# Altium project VCB20.PrjPCB (part 2 of 2)

## Sheet 9-Other_Inputs.SchDoc
size A4
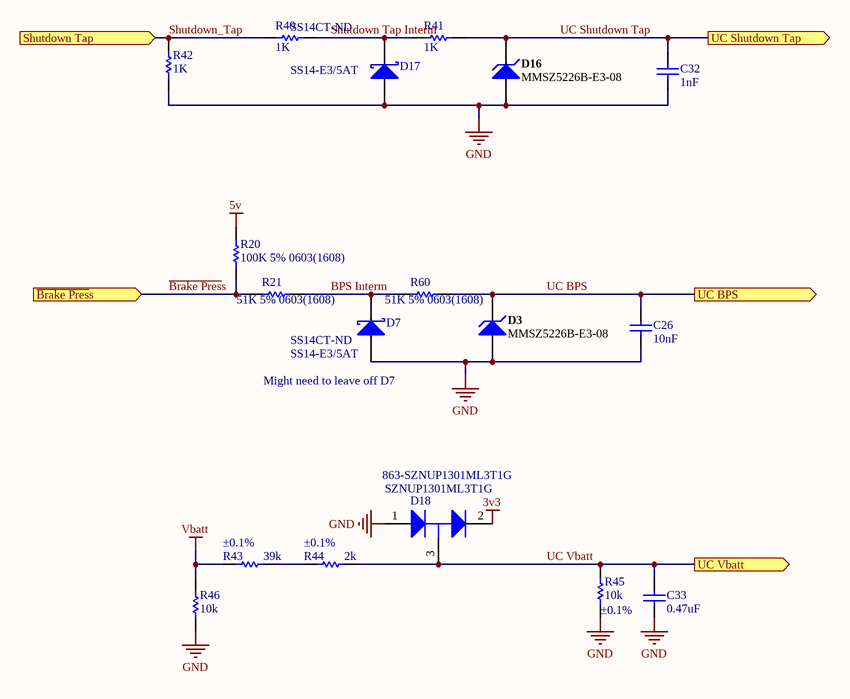
[diagram p6: 9-Other_Inputs.SchDoc]

### Parts
C26  value 10nF  [1608[0603]]  (hidden comment: Cap)
C32  value 1nF  [1608[0603]]  (hidden comment: Cap)
C33  value 0.47uF  [1608[0603]]  (hidden comment: Cap)
D3  MMSZ5226B-E3-08  [VISH-SOD-123-2_V]
D7  SS14-E3/5AT  Supplier Part Number 1: SS14CT-ND  [VISH-DO-214AC-2_V]
D16  MMSZ5226B-E3-08  [VISH-SOD-123-2_V]
D17  SS14-E3/5AT  Supplier Part Number 1: SS14CT-ND  [VISH-DO-214AC-2_V]
D18  SZNUP1301ML3T1G  Supplier Part Number 1: 863-SZNUP1301ML3T1G  [ONSC-SOT-23-3-318-08_V]
R20  100K 5% 0603(1608)  [RESC0603(1608)_N]
R21  51K 5% 0603(1608)  [RESC0603(1608)_N]
R40  value 1K  [1608[0603]]  (hidden comment: Res1)
R41  value 1K  [1608[0603]]  (hidden comment: Res1)
R42  value 1K  [1608[0603]]  (hidden comment: Res1)
R43  value 39k  Tolerance: ±0.1%  [1608[0603]]  (hidden comment: Res1)
R44  value 2k  Tolerance: ±0.1%  [1608[0603]]  (hidden comment: Res1)
R45  value 10k  Tolerance: ±0.1%  [1608[0603]]  (hidden comment: Res1)
R46  value 10k  [1608[0603]]  (hidden comment: Res1)
R60  51K 5% 0603(1608)  [RESC0603(1608)_N]

### Ports
Shutdown Tap (in), UC BPS (out), UC Shutdown Tap (out), UC Vbatt (out), ~{Brake Pres}s (in)

### Nets
3v3: D18.2(K)
5v: R20.2
GND: C26.1 C32.1 C33.1 D3.1(A) D7.1(A) D16.1(A) D17.1(A) D18.1(A) R42.1 R45.1 R46.1
Vbatt: R43.1 R46.2
~{Brake Pres}s: R20.1 R21.1 ; port ~{Brake Pres}s
BPS Interm: D7.2(K) R21.2 R60.1
Shutdown Tap Interm: D17.2(K) R40.1 R41.2
Shutdown_Tap: R40.2 R42.2 ; port Shutdown Tap  [project net Shutdown Tap]
UC BPS: C26.2 D3.2(K) R60.2 ; port UC BPS
UC Shutdown Tap: C32.2 D16.2(K) R41.1 ; port UC Shutdown Tap
UC Vbatt: C33.2 D18.3(K/A) R44.2 R45.2 ; port UC Vbatt
NetR43_2: R43.2 R44.1

### Notes on the sheet
- (near D7) Might need to leave off D7

### Library data of the parts
C26 = Cap: Capacitor; Manufacturer: Yageo; Manufacturer Part Number: CC0603KRX7R9BB104; Capacitance: 0.10µF; Tolerance: ±10%; Voltage - Rated: 50V; Temperature Coefficient: X7R; Supplier 1: Digi-Key; Supplier Part Number 1: 311-1344-1-ND; RoHS: RoHS Compliant; Category: Capacitors; Stock 1: 4016262; Pricing 1: 1=0.15, 10=0.043, 25=0.0312, 50=0.0232, 100=0.0189, 250=0.0158, 500=0.01346, 1000=0.01059 (CAD); Packaging: Cut Tape (CT); Part Status: Active; Operating Temperature: -55°C ~ 125°C; Features: -; Ratings: -; Applications: General Purpose; Failure Rate: -; Mounting Type: Surface Mount, MLCC; Package / Case: 0603 (1608 Metric); Size / Dimension: 0.063" L x 0.031" W (1.60mm x 0.80mm); Height - Seated (Max): -; Thickness (Max): 0.035" (0.90mm); Lead Spacing: -; Lead Style: -; ComponentLink1URL: http://www.yageo.com/documents/recent/UPY-GPHC_X7R_6.3V-to-50V_16.pdf; ComponentLink1Description: http://www.yageo.com/documents/recent/UPY-GPHC_X7R_6.3V-to-50V_16.pdf
C32 = Cap: Capacitor; Manufacturer: Yageo; Manufacturer Part Number: CC0603KRX7R9BB102; Capacitance: 1000pF; Tolerance: ±10%; Voltage - Rated: 50V; Temperature Coefficient: X7R; Supplier 1: Digi-Key; Supplier Part Number 1: 311-1080-1-ND; RoHS: RoHS Compliant; Category: Capacitors; Stock 1: 783486; Pricing 1: 1=0.15, 10=0.029, 25=0.0212, 50=0.0158, 100=0.0129, 250=0.01084, 500=0.00928, 1000=0.00729 (CAD); Packaging: Cut Tape (CT); Part Status: Active; Operating Temperature: -55°C ~ 125°C; Features: -; Ratings: -; Applications: General Purpose; Failure Rate: -; Mounting Type: Surface Mount, MLCC; Package / Case: 0603 (1608 Metric); Size / Dimension: 0.063" L x 0.031" W (1.60mm x 0.80mm); Height - Seated (Max): -; Thickness (Max): 0.035" (0.90mm); Lead Spacing: -; Lead Style: -; ComponentLink1URL: http://www.yageo.com/documents/recent/UPY-GPHC_X7R_6.3V-to-50V_16.pdf; ComponentLink1Description: http://www.yageo.com/documents/recent/UPY-GPHC_X7R_6.3V-to-50V_16.pdf
C33 = Cap: Capacitor; Manufacturer: Yageo; Manufacturer Part Number: CC0603KRX7R8BB474; Capacitance: 0.47µF; Tolerance: ±10%; Voltage - Rated: 25V; Temperature Coefficient: X7R; Supplier 1: Digi-Key; Supplier Part Number 1: 311-1805-1-ND; RoHS: RoHS Compliant; Category: Capacitors; Stock 1: 11076; Pricing 1: 1=0.22, 10=0.158, 25=0.1156, 50=0.0898, 100=0.0745, 250=0.06168, 500=0.05226, 1000=0.04324 (CAD); Packaging: Cut Tape (CT); Part Status: Active; Operating Temperature: -55°C ~ 125°C; Features: -; Ratings: -; Applications: General Purpose; Failure Rate: -; Mounting Type: Surface Mount, MLCC; Package / Case: 0603 (1608 Metric); Size / Dimension: 0.063" L x 0.031" W (1.60mm x 0.80mm); Height - Seated (Max): -; Thickness (Max): 0.035" (0.90mm); Lead Spacing: -; Lead Style: -; ComponentLink1URL: http://www.yageo.com/documents/recent/UPY-GPHC_X7R_6.3V-to-50V_16.pdf; ComponentLink1Description: http://www.yageo.com/documents/recent/UPY-GPHC_X7R_6.3V-to-50V_16.pdf
D3 D16 = CMP-0931-00026-1: Small Signal Zener Diode, 3.3 V +/- 5%, -55 to 155 degC, 2-Pin SOD-123, RoHS, Tape and Reel; Manufacturer: Vishay Semiconductor; Manufacturer Part Number: MMSZ5226B-7-F; Tolerance: +/- 5%; Test Current (IZT1) (mA): 20; Power Dissipation (mW): 500; Int. Construction: Single; Zener Impedance (IZT1) (Max.) (Ohm): 28; Zener Voltage (NOM.) (V): 3.3; Voltage - Zener (Nom) (Vz): 3.3V; Power - Max: 500mW; Impedance (Max) (Zzt): 28 Ohm; Current - Reverse Leakage @ Vr: 25µA @ 1V; Voltage - Forward (Vf) (Max) @ If: 900mV @ 10mA; DatasheetVersion: Rev. 1.9; ComponentLink2Description: Datasheet; PackageReference: SOD-123-2; ComponentLink1URL: http://www.vishay.com/; ComponentLink1Description: Manufacturer URL; Mounting Technology: Surface Mount; ComponentLink3Description: Package Specification; ComponentLink3URL: http://www.vishay.com/docs/85774/mmsz5225.pdf; PartNumber: MMSZ5226B-E3-08; PackageDescription: 2-Pin SMD, Body 2.7 x 1.55 mm, Height 1.35 mm; Operating Temperature: -55 to 150 degC; Packing: Tape and Reel; PackageVersion: Rev. 1.9; ComponentLink2URL: http://www.vishay.com/docs/85774/mmsz5225.pdf; RoHS: TRUE; Supplier 1: Digi-Key; Supplier Part Number 1: MMSZ5226B-FDICT-ND; Category: Discrete Semiconductor Products; Stock 1: 45935; Pricing 1: 1=0.29, 10=0.263, 100=0.1426, 500=0.08778, 1000=0.05985 (CAD); Packaging: Cut Tape (CT); Part Status: Active; Mounting Type: Surface Mount; Package / Case: SOD-123; Supplier Device Package: SOD-123; ComponentLink4URL: http://www.diodes.com/_files/datasheets/ds18010.pdf; ComponentLink4Description: http://www.diodes.com/_files/datasheets/ds18010.pdf
D7 D17 = CMP-0549-00004-1: Schottky Barrier Rectifier, 40 V Maximum DC Blocking Voltage, -65 to 125 degC, 2-Pin SMA Case, RoHS; Manufacturer: Vishay Semiconductor; IFSM: 40 A; IF(AV): 1 A Max.; VRRM: 40 V Max.; VRMS: 28 V Max.; PackageReference: DO-214AC-2; RoHS: TRUE; DatasheetVersion: 12/17/2012; ComponentLink1Description: Manufacturer URL; ComponentLink2URL: http://www.vishay.com/docs/88746/ss12.pdf; PartNumber: SS14-E3/5AT; PackageVersion: Dec-12; Operating Temperature: -65 to 125 degC; ComponentLink3URL: http://www.vishay.com/docs/88746/ss12.pdf; PackageDescription: 2-Pin SMD, Body 4.245 x 2.665 mm, Height 2.29 mm; ComponentLink1URL: http://www.vishay.com/; ComponentLink3Description: Package Specification; ComponentLink2Description: Datasheet; Mounting Technology: Surface Mount; VDC: 40 V Max.; Supplier 1: Digi-Key
D18 = CMP-1063-00171-1: Low Capacitance Diode Array for ESD Protection in a Single Data Line, 3-Pin SOT-23, Pb-Free, Tape and Reel; Manufacturer: On Semiconductor; C Max (pF): 0.9; Direction: Bidirectional; V(BR) Min (V): 70; Number of Lines: 1; Mounting Technology: Surface Mount; PackageReference: SOT-23-3-318-08; DatasheetVersion: Rev. 6; PackageVersion: Rev. AP, 11/2009; RoHS: Pb-Free; ComponentLink1Description: Manufacturer URL; ComponentLink1URL: http://www.onsemi.com/; PackageDescription: 3-Pin Small Outline Transistor, Body 2.92 x 1.3 mm, Pitch 0.95 mm; PartNumber: SZNUP1301ML3T1G; Packing: Tape and Reel; ComponentLink3URL: http://www.onsemi.cn/pub_link/Collateral/318-08.PDF; ComponentLink3Description: Package Specification; VRWM Max (V): 70; ComponentLink2Description: Datasheet; ComponentLink2URL: http://www.onsemi.cn/pub_link/Collateral/NUP1301ML3T1-D.PDF; Supplier 1: Mouser
R20 = CMP-1012-00122-1: 100K 0.1W 5% 0603 (1608 Metric)  SMD; Case-EIA: 0603; Value: 100000.00 Ohm; Case-Metric: 1608; Tolerance: 5 %; Power: 0.1 W; Technology: SMT
R21 R60 = CMP-1012-00115-1: 51K 0.1W 5% 0603 (1608 Metric)  SMD; Case-EIA: 0603; Case-Metric: 1608; Value: 51000.00 Ohm; Power: 0.1 W; Technology: SMT; Tolerance: 5 %
R40-R42 = Res1: Resistor; Manufacturer: Panasonic Electronic Components; Manufacturer Part Number: ERJ-PA3F1001V; Tolerance: ±1%; Power (Watts): 0.25W, 1/4W; Temperature Coefficient: ±100ppm/°C; Supplier 1: Digi-Key; Supplier Part Number 1: P1.0KBYCT-ND; RoHS: RoHS Compliant; Category: Resistors; Stock 1: 56110; Pricing 1: 1=0.22, 10=0.198, 25=0.138, 50=0.1072, 100=0.0765, 250=0.05972, 500=0.04746, 1000=0.03368 (CAD); Packaging: Cut Tape (CT); Part Status: Active; Resistance (Ohms): 1k; Composition: Thick Film; Features: Automotive AEC-Q200, Pulse Withstanding; Operating Temperature: -55°C ~ 155°C; Package / Case: 0603 (1608 Metric); Supplier Device Package: 0603; Size / Dimension: 0.063" L x 0.031" W (1.60mm x 0.80mm); Height - Seated (Max): 0.022" (0.55mm); Number of Terminations: 2; Failure Rate: -; ComponentLink1URL: https://industrial.panasonic.com/cdbs/www-data/pdf/RDA0000/AOA0000C243.pdf; ComponentLink1Description: https://industrial.panasonic.com/cdbs/www-data/pdf/RDA0000/AOA0000C243.pdf
R43 = Res1: Resistor; Manufacturer: Yageo; Manufacturer Part Number: RT0603BRD0739KL; Power (Watts): 0.1W, 1/10W; Temperature Coefficient: ±25ppm/°C; Supplier 1: Digi-Key; Supplier Part Number 1: YAG1649CT-ND; RoHS: RoHS Compliant; Category: Resistors; Stock 1: 2740; Pricing 1: 1=0.55, 10=0.464, 25=0.3376, 50=0.2446, 100=0.1814, 250=0.1392, 500=0.10966, 1000=0.07592 (CAD); Packaging: Cut Tape (CT); Part Status: Active; Resistance (Ohms): 39k; Composition: Thin Film; Features: Moisture Resistant; Operating Temperature: -55°C ~ 155°C; Package / Case: 0603 (1608 Metric); Supplier Device Package: 0603; Size / Dimension: 0.063" L x 0.031" W (1.60mm x 0.80mm); Height - Seated (Max): 0.022" (0.55mm); Number of Terminations: 2; Failure Rate: -; ComponentLink1URL: http://www.yageo.com/documents/recent/PYu-RT_1-to-0.05_RoHS_L_6.pdf; ComponentLink1Description: http://www.yageo.com/documents/recent/PYu-RT_1-to-0.05_RoHS_L_6.pdf
R44 = Res1: Resistor; Manufacturer: Yageo; Manufacturer Part Number: AT0603BRD072KL; Power (Watts): 0.1W, 1/10W; Temperature Coefficient: ±25ppm/°C; Supplier 1: Digi-Key; Supplier Part Number 1: YAG2112CT-ND; RoHS: RoHS Compliant; Category: Resistors; Stock 1: 1218; Pricing 1: 1=0.59, 10=0.431, 25=0.3188, 50=0.235, 100=0.1725, 250=0.14248, 500=0.11746, 1000=0.08498 (CAD); Packaging: Cut Tape (CT); Part Status: Active; Resistance (Ohms): 2k; Composition: Thin Film; Features: Anti-Sulfur, Automotive AEC-Q200, Moisture Resistant; Operating Temperature: -55°C ~ 155°C; Package / Case: 0603 (1608 Metric); Supplier Device Package: 0603; Size / Dimension: 0.063" L x 0.032" W (1.60mm x 0.80mm); Height - Seated (Max): 0.022" (0.55mm); Number of Terminations: 2; Failure Rate: -; ComponentLink1URL: http://www.yageo.com/documents/recent/PYu-AT_51_RoHS_L-3.pdf; ComponentLink1Description: http://www.yageo.com/documents/recent/PYu-AT_51_RoHS_L-3.pdf
R45 = Res1: Resistor; Manufacturer: Yageo; Manufacturer Part Number: RT0603BRD0710KL; Power (Watts): 0.1W, 1/10W; Temperature Coefficient: ±25ppm/°C; Supplier 1: Digi-Key; Supplier Part Number 1: YAG1236CT-ND; RoHS: RoHS Compliant; Category: Resistors; Stock 1: 2958; Pricing 1: 1=0.5, 10=0.42, 25=0.3048, 50=0.2212, 100=0.164, 250=0.12592, 500=0.0992, 1000=0.06867 (CAD); Packaging: Cut Tape (CT); Part Status: Active; Resistance (Ohms): 10k; Composition: Thin Film; Features: Moisture Resistant; Operating Temperature: -55°C ~ 155°C; Package / Case: 0603 (1608 Metric); Supplier Device Package: 0603; Size / Dimension: 0.063" L x 0.031" W (1.60mm x 0.80mm); Height - Seated (Max): 0.022" (0.55mm); Number of Terminations: 2; Failure Rate: -; ComponentLink1URL: http://www.yageo.com/documents/recent/PYu-RT_1-to-0.05_RoHS_L_6.pdf; ComponentLink1Description: http://www.yageo.com/documents/recent/PYu-RT_1-to-0.05_RoHS_L_6.pdf
R46 = Res1: Resistor; Manufacturer: Yageo; Manufacturer Part Number: RC0603JR-0710KL; Tolerance: ±5%; Power (Watts): 0.1W, 1/10W; Temperature Coefficient: ±100ppm/°C; Supplier 1: Digi-Key; Supplier Part Number 1: 311-10KGRCT-ND; RoHS: RoHS Compliant; Category: Resistors; Stock 1: 2936292; Pricing 1: 1=0.16, 10=0.016, 25=0.0112, 50=0.0084, 100=0.0062, 250=0.0048, 500=0.00382, 1000=0.00281 (CAD); Packaging: Cut Tape (CT); Part Status: Active; Resistance (Ohms): 10k; Composition: Thick Film; Features: Moisture Resistant; Operating Temperature: -55°C ~ 155°C; Package / Case: 0603 (1608 Metric); Supplier Device Package: 0603; Size / Dimension: 0.063" L x 0.031" W (1.60mm x 0.80mm); Height - Seated (Max): 0.022" (0.55mm); Number of Terminations: 2; Failure Rate: -; ComponentLink1URL: http://www.yageo.com/NewPortal/yageodocoutput?fileName=/pdf/R-Chip/PYu-RC_Group_51_RoHS_L_4.pdf; ComponentLink1Description: http://www.yageo.com/NewPortal/yageodocoutput?fileName=/pdf/R-Chip/PYu-RC_Group_51_RoHS_L_4.pdf

## Sheet 10-DashLEDs.SchDoc
size A4
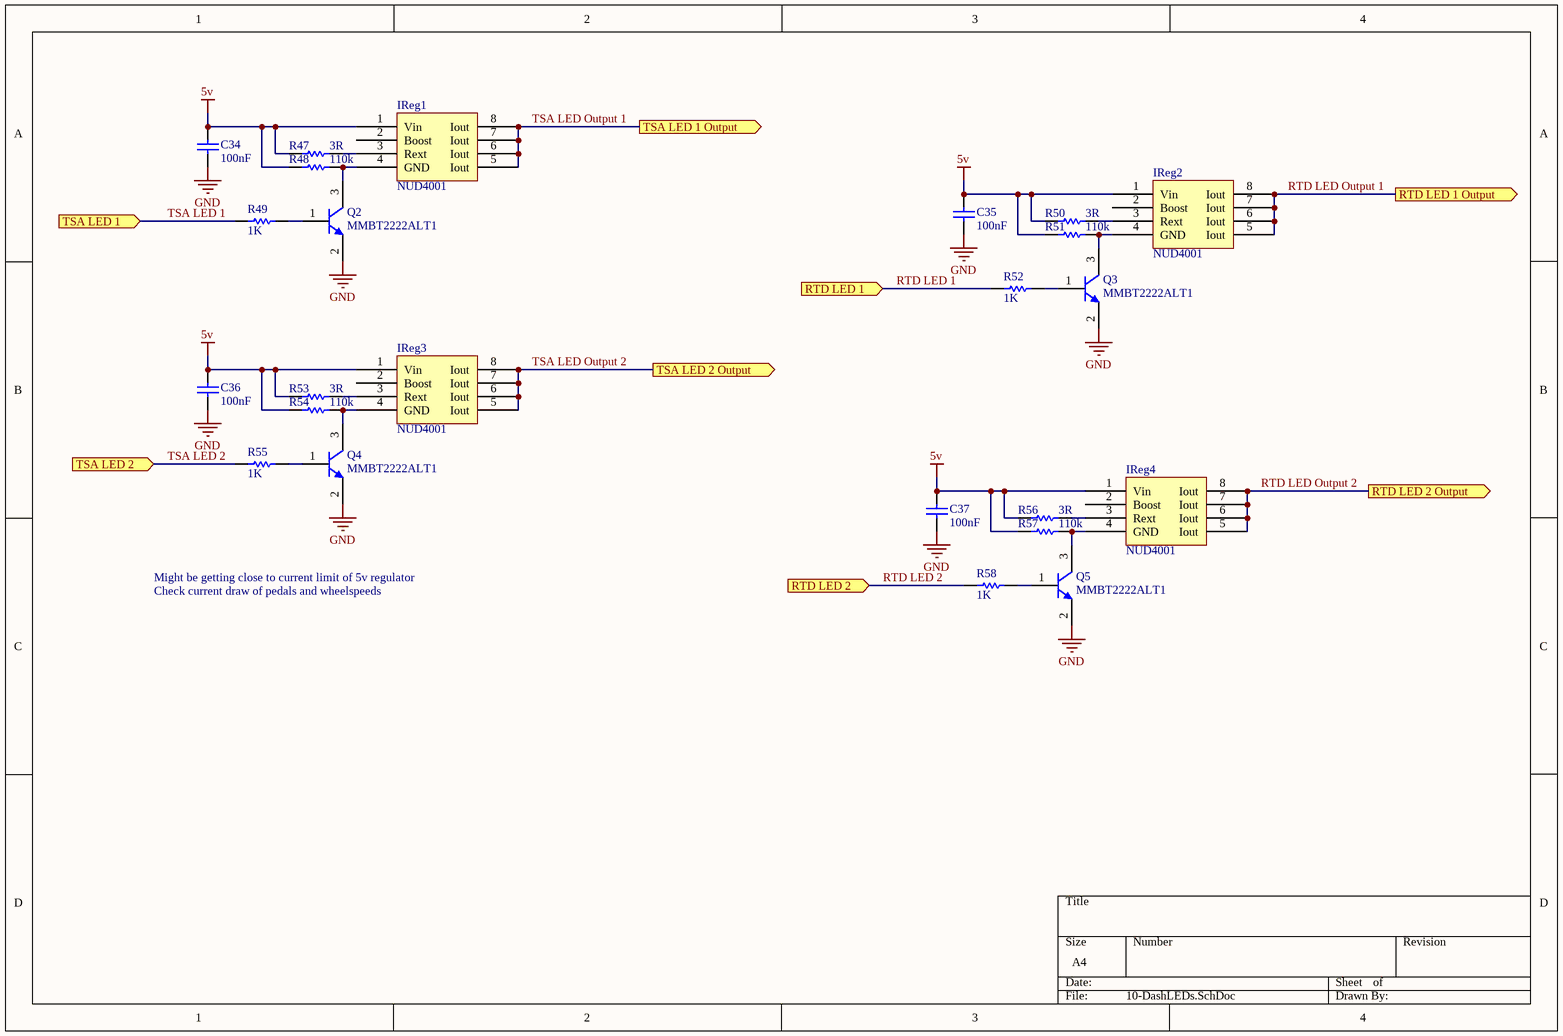
[diagram p7: 10-DashLEDs.SchDoc]

### Parts
C34  value 100nF  [1608[0603]]  (hidden comment: Cap)
C35  value 100nF  [1608[0603]]  (hidden comment: Cap)
C36  value 100nF  [1608[0603]]  (hidden comment: Cap)
C37  value 100nF  [1608[0603]]  (hidden comment: Cap)
IReg1  NUD4001  [SO8_M]
IReg2  NUD4001  [SO8_M]
IReg3  NUD4001  [SO8_M]
IReg4  NUD4001  [SO8_M]
Q2  MMBT2222ALT1  [ONSC-SOT-23-3-318-08_V]
Q3  MMBT2222ALT1  [ONSC-SOT-23-3-318-08_V]
Q4  MMBT2222ALT1  [ONSC-SOT-23-3-318-08_V]
Q5  MMBT2222ALT1  [ONSC-SOT-23-3-318-08_V]
R47  value 3R  [1608[0603]]  (hidden comment: Res1)
R48  value 110k  [1608[0603]]  (hidden comment: Res1)
R49  value 1K  [1608[0603]]  (hidden comment: Res1)
R50  value 3R  [1608[0603]]  (hidden comment: Res1)
R51  value 110k  [1608[0603]]  (hidden comment: Res1)
R52  value 1K  [1608[0603]]  (hidden comment: Res1)
R53  value 3R  [1608[0603]]  (hidden comment: Res1)
R54  value 110k  [1608[0603]]  (hidden comment: Res1)
R55  value 1K  [1608[0603]]  (hidden comment: Res1)
R56  value 3R  [1608[0603]]  (hidden comment: Res1)
R57  value 110k  [1608[0603]]  (hidden comment: Res1)
R58  value 1K  [1608[0603]]  (hidden comment: Res1)

### Ports
RTD LED 1 (in), RTD LED 1 Output (out), RTD LED 2 (in), RTD LED 2 Output (out), TSA LED 1 (in), TSA LED 1 Output (out), TSA LED 2 (in), TSA LED 2 Output (out)

### Nets
5v: C34.2 C35.2 C36.2 C37.2 IReg1.1(Vin) IReg2.1(Vin) IReg3.1(Vin) IReg4.1(Vin) R47.1 R48.1 R50.1 R51.1 R53.1 R54.1 R56.1 R57.1
GND: C34.1 C35.1 C36.1 C37.1 Q2.2(E) Q3.2(E) Q4.2(E) Q5.2(E)
RTD LED 1: R52.2 ; port RTD LED 1
RTD LED 2: R58.2 ; port RTD LED 2
RTD LED Output 1: IReg2.5(Iout) IReg2.6(Iout) IReg2.7(Iout) IReg2.8(Iout) ; port RTD LED 1 Output  [project net RTD LED 1 Output]
RTD LED Output 2: IReg4.5(Iout) IReg4.6(Iout) IReg4.7(Iout) IReg4.8(Iout) ; port RTD LED 2 Output  [project net RTD LED 2 Output]
TSA LED 1: R49.2 ; port TSA LED 1
TSA LED 2: R55.2 ; port TSA LED 2
TSA LED Output 1: IReg1.5(Iout) IReg1.6(Iout) IReg1.7(Iout) IReg1.8(Iout) ; port TSA LED 1 Output  [project net TSA LED 1 Output]
TSA LED Output 2: IReg3.5(Iout) IReg3.6(Iout) IReg3.7(Iout) IReg3.8(Iout) ; port TSA LED 2 Output  [project net TSA LED 2 Output]
NetIReg1_3: IReg1.3(Rext) R47.2
NetIReg1_4: IReg1.4(GND) Q2.3(C) R48.2
NetIReg2_3: IReg2.3(Rext) R50.2
NetIReg2_4: IReg2.4(GND) Q3.3(C) R51.2
NetIReg3_3: IReg3.3(Rext) R53.2
NetIReg3_4: IReg3.4(GND) Q4.3(C) R54.2
NetIReg4_3: IReg4.3(Rext) R56.2
NetIReg4_4: IReg4.4(GND) Q5.3(C) R57.2
NetQ2_1: Q2.1(B) R49.1
NetQ3_1: Q3.1(B) R52.1
NetQ4_1: Q4.1(B) R55.1
NetQ5_1: Q5.1(B) R58.1

Not connected (* = marked no-connect by the designer): IReg1 2(Boost); IReg2 2(Boost); IReg3 2(Boost); IReg4 2(Boost)

### Notes on the sheet
- Might be getting close to current limit of 5v regulator
- Check current draw of pedals and wheelspeeds

### Library data of the parts
C34-C37 = Cap: as C26 on sheet 9-Other_Inputs; Supplier 1: Digi-Key; Supplier Part Number 1: 311-1344-1-ND; RoHS: RoHS Compliant; Category: Capacitors; Stock 1: 4016262; Pricing 1: 1=0.15, 10=0.043, 25=0.0312, 50=0.0232, 100=0.0189, 250=0.0158, 500=0.01346, 1000=0.01059 (CAD); Packaging: Cut Tape (CT); Part Status: Active; Operating Temperature: -55°C ~ 125°C; Features: -; Ratings: -; Applications: General Purpose; Failure Rate: -; Mounting Type: Surface Mount, MLCC; Package / Case: 0603 (1608 Metric); Size / Dimension: 0.063" L x 0.031" W (1.60mm x 0.80mm); Height - Seated (Max): -; Thickness (Max): 0.035" (0.90mm); Lead Spacing: -; Lead Style: -; ComponentLink1URL: http://www.yageo.com/documents/recent/UPY-GPHC_X7R_6.3V-to-50V_16.pdf; ComponentLink1Description: http://www.yageo.com/documents/recent/UPY-GPHC_X7R_6.3V-to-50V_16.pdf
IReg1-IReg4 = LED Currnet Driver, 500mA, 30V max: Manufacturer: ON Semiconductor; Manufacturer Part Number: NUD4001DR2G; Internal Switch(s): Yes; Number of Outputs: 1; Voltage - Supply (Min): 3.6V; Voltage - Supply (Max): 30V; Voltage - Output: 28V; Current - Output / Channel: 500mA; Dimming: PWM; Supplier 1: Digi-Key; Supplier Part Number 1: NUD4001DR2GOSCT-ND; RoHS: RoHS Compliant; Category: Integrated Circuits (ICs); Stock 1: 212669; Pricing 1: 1=1.36, 10=1.197, 100=0.9174, 500=0.72524, 1000=0.58019 (CAD); Packaging: Cut Tape (CT); Part Status: Active; Type: Linear; Topology: -; Frequency: -; Applications: Automotive, Lighting; Operating Temperature: -40°C ~ 125°C (TA); Mounting Type: Surface Mount; Package / Case: 8-SOIC (0.154", 3.90mm Width); Supplier Device Package: 8-SOIC; ComponentLink1URL: http://www.onsemi.com/pub_link/Collateral/NUD4001-D.PDF; ComponentLink1Description: http://www.onsemi.com/pub_link/Collateral/NUD4001-D.PDF
Q2-Q5 = CMP-1048-00593-1: General Purpose Transistor, NPN Silicon, 3-Pin SOT-23, Tape and Reel; Manufacturer: On Semiconductor; fT Min (MHz): 300; IC Continuous (A): 0.6; ComponentLink1Description: Manufacturer URL; PackageDescription: 3-Pin Small Outline Transistor, Body 2.92 x 1.3 mm, Pitch 0.95 mm; PackageReference: SOT-23-3-318-08; Polarity: NPN; Packing: Tape and Reel; RoHS: FALSE; Mounting Technology: Surface Mount; PackageVersion: Rev. AP, 11/2009; DatasheetVersion: Rev. 10; PartNumber: MMBT2222ALT1; ComponentLink3Description: Package Specification; ComponentLink2Description: Datasheet; ComponentLink3URL: http://www.onsemi.cn/pub_link/Collateral/318-08.PDF; ComponentLink1URL: http://www.onsemi.com/; ComponentLink2URL: http://www.onsemi.cn/pub_link/Collateral/MMBT2222LT1-D.PDF
R47 R50 R53 R56 = Res1: Resistor; Manufacturer: Yageo; Manufacturer Part Number: RC0603FR-072RL; Resistance (Ohms): 2; Tolerance: ±1%; Power (Watts): 0.1W, 1/10W; Temperature Coefficient: ±200ppm/°C; Supplier 1: Digi-Key; Supplier Part Number 1: 311-2.00HRCT-ND; RoHS: RoHS Compliant; Category: Resistors; Stock 1: 84378; Pricing 1: 1=0.16, 10=0.03, 25=0.022, 50=0.0166, 100=0.0122, 250=0.00936, 500=0.00746, 1000=0.0055 (CAD); Packaging: Cut Tape (CT); Part Status: Active; Composition: Thick Film; Features: Moisture Resistant; Operating Temperature: -55°C ~ 155°C; Package / Case: 0603 (1608 Metric); Supplier Device Package: 0603; Size / Dimension: 0.063" L x 0.031" W (1.60mm x 0.80mm); Height - Seated (Max): 0.022" (0.55mm); Number of Terminations: 2; Failure Rate: -; ComponentLink1URL: http://www.yageo.com/NewPortal/yageodocoutput?fileName=/pdf/R-Chip/PYu-RC_Group_51_RoHS_L_4.pdf; ComponentLink1Description: http://www.yageo.com/NewPortal/yageodocoutput?fileName=/pdf/R-Chip/PYu-RC_Group_51_RoHS_L_4.pdf
R48 R51 R54 R57 = Res1: Resistor; Manufacturer: Yageo; Manufacturer Part Number: RC0603JR-07110KL; Tolerance: ±5%; Power (Watts): 0.1W, 1/10W; Temperature Coefficient: ±100ppm/°C; Supplier 1: Digi-Key; Supplier Part Number 1: 311-110KGRCT-ND; RoHS: RoHS Compliant; Category: Resistors; Stock 1: 85509; Pricing 1: 1=0.16, 10=0.016, 25=0.0112, 50=0.0084, 100=0.0062, 250=0.0048, 500=0.00382, 1000=0.00281 (CAD); Packaging: Cut Tape (CT); Part Status: Active; Resistance (Ohms): 110k; Composition: Thick Film; Features: Moisture Resistant; Operating Temperature: -55°C ~ 155°C; Package / Case: 0603 (1608 Metric); Supplier Device Package: 0603; Size / Dimension: 0.063" L x 0.031" W (1.60mm x 0.80mm); Height - Seated (Max): 0.022" (0.55mm); Number of Terminations: 2; Failure Rate: -; ComponentLink1URL: http://www.yageo.com/NewPortal/yageodocoutput?fileName=/pdf/R-Chip/PYu-RC_Group_51_RoHS_L_4.pdf; ComponentLink1Description: http://www.yageo.com/NewPortal/yageodocoutput?fileName=/pdf/R-Chip/PYu-RC_Group_51_RoHS_L_4.pdf
R49 R52 R55 R58 = Res1: as R40 on sheet 9-Other_Inputs; Supplier 1: Digi-Key; Supplier Part Number 1: P1.0KBYCT-ND; RoHS: RoHS Compliant; Category: Resistors; Stock 1: 56110; Pricing 1: 1=0.22, 10=0.198, 25=0.138, 50=0.1072, 100=0.0765, 250=0.05972, 500=0.04746, 1000=0.03368 (CAD); Packaging: Cut Tape (CT); Part Status: Active; Resistance (Ohms): 1k; Composition: Thick Film; Features: Automotive AEC-Q200, Pulse Withstanding; Operating Temperature: -55°C ~ 155°C; Package / Case: 0603 (1608 Metric); Supplier Device Package: 0603; Size / Dimension: 0.063" L x 0.031" W (1.60mm x 0.80mm); Height - Seated (Max): 0.022" (0.55mm); Number of Terminations: 2; Failure Rate: -; ComponentLink1URL: https://industrial.panasonic.com/cdbs/www-data/pdf/RDA0000/AOA0000C243.pdf; ComponentLink1Description: https://industrial.panasonic.com/cdbs/www-data/pdf/RDA0000/AOA0000C243.pdf

## Sheet 12-Dash_Inputs.SchDoc
size A4
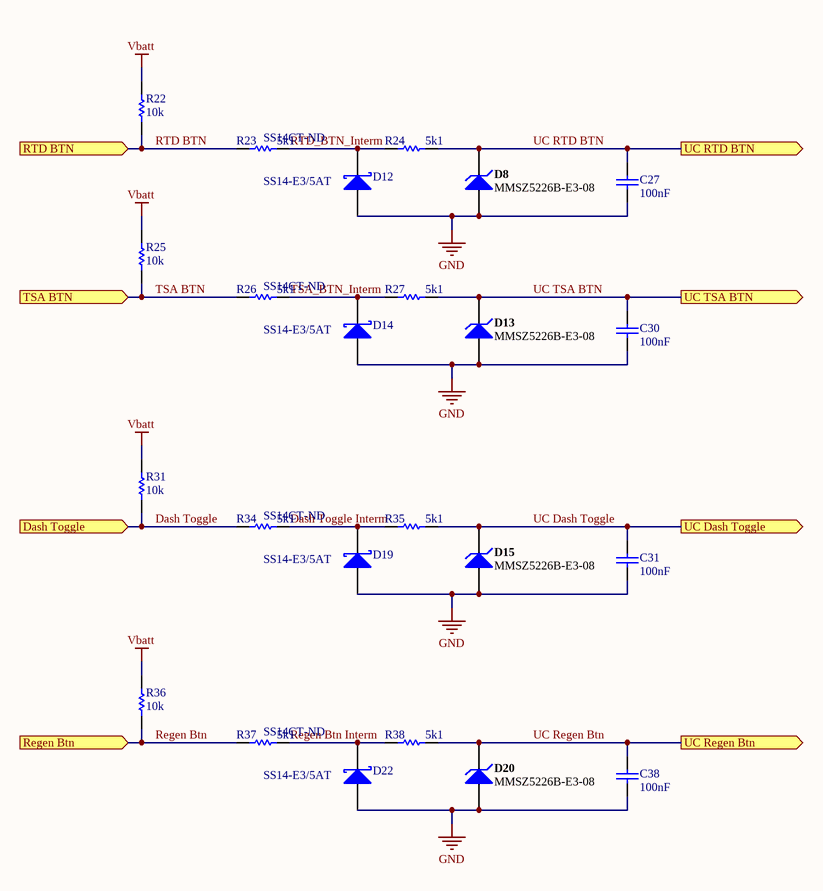
[diagram p8: 12-Dash_Inputs.SchDoc]

### Parts
C27  value 100nF  [1608[0603]]  (hidden comment: Cap)
C30  value 100nF  [1608[0603]]  (hidden comment: Cap)
C31  value 100nF  [1608[0603]]  (hidden comment: Cap)
C38  value 100nF  [1608[0603]]  (hidden comment: Cap)
D8  MMSZ5226B-E3-08  [VISH-SOD-123-2_V]
D12  SS14-E3/5AT  Supplier Part Number 1: SS14CT-ND  [VISH-DO-214AC-2_V]
D13  MMSZ5226B-E3-08  [VISH-SOD-123-2_V]
D14  SS14-E3/5AT  Supplier Part Number 1: SS14CT-ND  [VISH-DO-214AC-2_V]
D15  MMSZ5226B-E3-08  [VISH-SOD-123-2_V]
D19  SS14-E3/5AT  Supplier Part Number 1: SS14CT-ND  [VISH-DO-214AC-2_V]
D20  MMSZ5226B-E3-08  [VISH-SOD-123-2_V]
D22  SS14-E3/5AT  Supplier Part Number 1: SS14CT-ND  [VISH-DO-214AC-2_V]
R22  value 10k  [1608[0603]]  (hidden comment: Res1)
R23  value 5k1  [1608[0603]]  (hidden comment: Res1)
R24  value 5k1  [1608[0603]]  (hidden comment: Res1)
R25  value 10k  [1608[0603]]  (hidden comment: Res1)
R26  value 5k1  [1608[0603]]  (hidden comment: Res1)
R27  value 5k1  [1608[0603]]  (hidden comment: Res1)
R31  value 10k  [1608[0603]]  (hidden comment: Res1)
R34  value 5k1  [1608[0603]]  (hidden comment: Res1)
R35  value 5k1  [1608[0603]]  (hidden comment: Res1)
R36  value 10k  [1608[0603]]  (hidden comment: Res1)
R37  value 5k1  [1608[0603]]  (hidden comment: Res1)
R38  value 5k1  [1608[0603]]  (hidden comment: Res1)

### Ports
Dash Toggle (in), Regen Btn (in), RTD BTN (in), TSA BTN (in), UC Dash Toggle (out), UC Regen Btn (out), UC RTD BTN (out), UC TSA BTN (out)

### Nets
GND: C27.1 C30.1 C31.1 C38.1 D8.1(A) D12.1(A) D13.1(A) D14.1(A) D15.1(A) D19.1(A) D20.1(A) D22.1(A)
Vbatt: R22.2 R25.2 R31.2 R36.2
Dash Toggle: R31.1 R34.1 ; port Dash Toggle
Dash Toggle Interm: D19.2(K) R34.2 R35.1
Regen Btn: R36.1 R37.1 ; port Regen Btn
Regen Btn Interm: D22.2(K) R37.2 R38.1
RTD BTN: R22.1 R23.1 ; port RTD BTN
RTD_BTN_Interm: D12.2(K) R23.2 R24.1
TSA BTN: R25.1 R26.1 ; port TSA BTN
TSA_BTN_Interm: D14.2(K) R26.2 R27.1
UC Dash Toggle: C31.2 D15.2(K) R35.2 ; port UC Dash Toggle
UC Regen Btn: C38.2 D20.2(K) R38.2 ; port UC Regen Btn
UC RTD BTN: C27.2 D8.2(K) R24.2 ; port UC RTD BTN
UC TSA BTN: C30.2 D13.2(K) R27.2 ; port UC TSA BTN

### Library data of the parts
C27 C30 C31 C38 = Cap: as C26 on sheet 9-Other_Inputs; Supplier 1: Digi-Key; Supplier Part Number 1: 311-1344-1-ND; RoHS: RoHS Compliant; Category: Capacitors; Stock 1: 4016262; Pricing 1: 1=0.15, 10=0.043, 25=0.0312, 50=0.0232, 100=0.0189, 250=0.0158, 500=0.01346, 1000=0.01059 (CAD); Packaging: Cut Tape (CT); Part Status: Active; Operating Temperature: -55°C ~ 125°C; Features: -; Ratings: -; Applications: General Purpose; Failure Rate: -; Mounting Type: Surface Mount, MLCC; Package / Case: 0603 (1608 Metric); Size / Dimension: 0.063" L x 0.031" W (1.60mm x 0.80mm); Height - Seated (Max): -; Thickness (Max): 0.035" (0.90mm); Lead Spacing: -; Lead Style: -; ComponentLink1URL: http://www.yageo.com/documents/recent/UPY-GPHC_X7R_6.3V-to-50V_16.pdf; ComponentLink1Description: http://www.yageo.com/documents/recent/UPY-GPHC_X7R_6.3V-to-50V_16.pdf
D8 D13 D15 D20 = CMP-0931-00026-1: as D3 on sheet 9-Other_Inputs; DatasheetVersion: Rev. 1.9; ComponentLink2Description: Datasheet; PackageReference: SOD-123-2; ComponentLink1URL: http://www.vishay.com/; ComponentLink1Description: Manufacturer URL; Mounting Technology: Surface Mount; ComponentLink3Description: Package Specification; ComponentLink3URL: http://www.vishay.com/docs/85774/mmsz5225.pdf; PartNumber: MMSZ5226B-E3-08; PackageDescription: 2-Pin SMD, Body 2.7 x 1.55 mm, Height 1.35 mm; Operating Temperature: -55 to 150 degC; Packing: Tape and Reel; PackageVersion: Rev. 1.9; ComponentLink2URL: http://www.vishay.com/docs/85774/mmsz5225.pdf; RoHS: TRUE; Supplier 1: Digi-Key; Supplier Part Number 1: MMSZ5226B-FDICT-ND; Category: Discrete Semiconductor Products; Stock 1: 45935; Pricing 1: 1=0.29, 10=0.263, 100=0.1426, 500=0.08778, 1000=0.05985 (CAD); Packaging: Cut Tape (CT); Part Status: Active; Mounting Type: Surface Mount; Package / Case: SOD-123; Supplier Device Package: SOD-123; ComponentLink4URL: http://www.diodes.com/_files/datasheets/ds18010.pdf; ComponentLink4Description: http://www.diodes.com/_files/datasheets/ds18010.pdf
D12 D14 D19 D22 = CMP-0549-00004-1: as D7 on sheet 9-Other_Inputs; PackageReference: DO-214AC-2; RoHS: TRUE; DatasheetVersion: 12/17/2012; ComponentLink1Description: Manufacturer URL; ComponentLink2URL: http://www.vishay.com/docs/88746/ss12.pdf; PartNumber: SS14-E3/5AT; PackageVersion: Dec-12; Operating Temperature: -65 to 125 degC; ComponentLink3URL: http://www.vishay.com/docs/88746/ss12.pdf; PackageDescription: 2-Pin SMD, Body 4.245 x 2.665 mm, Height 2.29 mm; ComponentLink1URL: http://www.vishay.com/; ComponentLink3Description: Package Specification; ComponentLink2Description: Datasheet; Mounting Technology: Surface Mount; VDC: 40 V Max.; Supplier 1: Digi-Key
R22 R25 R31 R36 = Res1: as R46 on sheet 9-Other_Inputs; Supplier 1: Digi-Key; Supplier Part Number 1: 311-10KGRCT-ND; RoHS: RoHS Compliant; Category: Resistors; Stock 1: 2936292; Pricing 1: 1=0.16, 10=0.016, 25=0.0112, 50=0.0084, 100=0.0062, 250=0.0048, 500=0.00382, 1000=0.00281 (CAD); Packaging: Cut Tape (CT); Part Status: Active; Resistance (Ohms): 10k; Composition: Thick Film; Features: Moisture Resistant; Operating Temperature: -55°C ~ 155°C; Package / Case: 0603 (1608 Metric); Supplier Device Package: 0603; Size / Dimension: 0.063" L x 0.031" W (1.60mm x 0.80mm); Height - Seated (Max): 0.022" (0.55mm); Number of Terminations: 2; Failure Rate: -; ComponentLink1URL: http://www.yageo.com/NewPortal/yageodocoutput?fileName=/pdf/R-Chip/PYu-RC_Group_51_RoHS_L_4.pdf; ComponentLink1Description: http://www.yageo.com/NewPortal/yageodocoutput?fileName=/pdf/R-Chip/PYu-RC_Group_51_RoHS_L_4.pdf
R23 R24 R26 R27 R34 R35 R37 R38 = Res1: Resistor; Manufacturer: Yageo; Manufacturer Part Number: RC0603JR-075K1L; Resistance (Ohms): 5.1k; Tolerance: ±5%; Power (Watts): 0.1W, 1/10W; Temperature Coefficient: ±100ppm/°C; Supplier 1: Digi-Key; Supplier Part Number 1: 311-5.1KGRCT-ND; RoHS: RoHS Compliant; Category: Resistors; Stock 1: 782184; Pricing 1: 1=0.16, 10=0.016, 25=0.0112, 50=0.0084, 100=0.0062, 250=0.0048, 500=0.00382, 1000=0.00281 (CAD); Packaging: Cut Tape (CT); Part Status: Active; Composition: Thick Film; Features: Moisture Resistant; Operating Temperature: -55°C ~ 155°C; Package / Case: 0603 (1608 Metric); Supplier Device Package: 0603; Size / Dimension: 0.063" L x 0.031" W (1.60mm x 0.80mm); Height - Seated (Max): 0.022" (0.55mm); Number of Terminations: 2; Failure Rate: -; ComponentLink1URL: http://www.yageo.com/NewPortal/yageodocoutput?fileName=/pdf/R-Chip/PYu-RC_Group_51_RoHS_L_4.pdf; ComponentLink1Description: http://www.yageo.com/NewPortal/yageodocoutput?fileName=/pdf/R-Chip/PYu-RC_Group_51_RoHS_L_4.pdf

## Sheet 13-Fusing.SchDoc
size A4
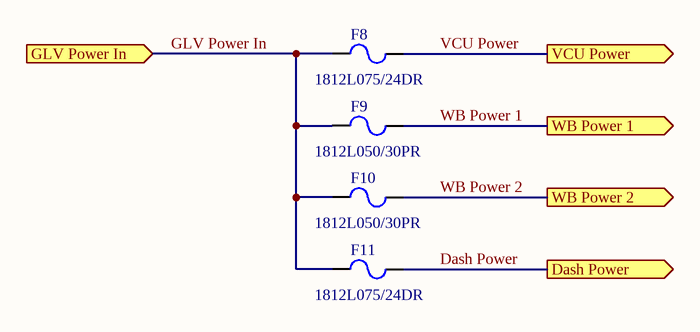
[diagram p9: 13-Fusing.SchDoc]

### Parts
F8  1812L075/24DR  [LFUS-1812L07524DR_V]
F9  1812L050/30PR  [LFUS-1812L05030PR_V]
F10  1812L050/30PR  [LFUS-1812L05030PR_V]
F11  1812L075/24DR  [LFUS-1812L07524DR_V]

### Ports
Dash Power (out), GLV Power In (in), VCU Power (out), WB Power 1 (out), WB Power 2 (out)

### Nets
Dash Power: F11.2 ; port Dash Power
GLV Power In: F8.1 F9.1 F10.1 F11.1 ; port GLV Power In
VCU Power: F8.2 ; port VCU Power
WB Power 1: F9.2 ; port WB Power 1
WB Power 2: F10.2 ; port WB Power 2

### Library data of the parts
F8 F11 = CMP-2000-05510-1: Poly-Fuse(R) Resettable PTC, 24 V, 100 A, -40 to 85 degC, 2-Pin SMD, RoHS, Tape and Reel; Manufacturer: Littelfuse; Resistance: 290mOhms; Current Rating - Max: 100A; Maximum Voltage: 24VDC; Hold Current: 0.75A; Trip Current: 1.5A; Maximum Voltage DC: 24V; Type: PolyFuseResettablePTC; Datasheet Version: 02/2016; Package / Case: 1812(4532metric); Mounting Technology: SurfaceMount; Packaging: Reel; Package Description: 2-Pin Surface Mount Device, Body 4.55 x 3.24 mm; Brand: Littelfuse; Manufacturer URL: http://www.littelfuse.com/; Mounting Style: SMD/SMT; Dimensions: 4.37mmLx3.07mmWx0.75mmH; Operating Temperature Range: -40Cto+85C; Product Category: ResettableFuses-PPTC; Current Rating: 100A; Termination Style: SMD/SMT; Factory Pack Quantity: 1500; Current Rating (Max): 100A; Package Reference: 1812L07524DR; RoHS: Details; Series: 1812L; Datasheet URL: http://www.littelfuse.com/~/media/electronics/datasheets/resettable_ptcs/littelfuse_ptc_1812l_datasheet.pdf.pdf
F9 F10 = CMP-2000-05508-1: PTC Resettable Fuse, 0.8 W, 30 V, -40 to 85 degC, 2-Pin SMD, RoHS, Tape and Reel; Manufacturer: Littelfuse-Inc.; Voltage - Max: 30V; Current - Hold (Ih) (Max): 500mA; Time to Trip: 0.15s; Current - Max: 100A; R Min/Max: 0.150~1.000Ohm; Current - Trip (It): 1A; Package Reference: 1812; Family: PTCResettableFuses; Packaging: Tape&Reel(TR); Package / Case: 1812(4532Metric),Concave; Series: POLY-FUSE®,1812L; Mounting Technology: SurfaceMount; Datasheet Version: 02/2016; Datasheet URL: http://www.littelfuse.com/~/media/electronics/datasheets/resettable_ptcs/littelfuse_ptc_1812l_datasheet.pdf.pdf; Manufacturer URL: http://www.littelfuse.com/; Category: CircuitProtection; Package Description: 2-Pin Surface Mount Device, Body 4.55 x 3.24 mm

## Sheet 14-RegenSolenoid.SchDoc
size A4
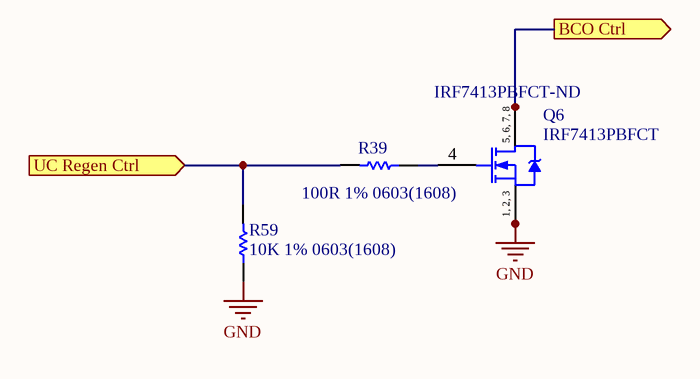
[diagram p10: 14-RegenSolenoid.SchDoc]

### Parts
Q6  IRF7413PBFCT  Supplier Part Number 1: IRF7413PBFCT-ND  [INTR-SO-8_V]
R39  100R 1% 0603(1608)  [RESC0603(1608)_N]
R59  10K 1% 0603(1608)  [RESC0603(1608)_N]

### Ports
BCO Ctrl (out), UC Regen Ctrl (in)

### Nets
GND: Q6.1(S) Q6.2(S) Q6.3(S) R59.1
BCO Ctrl: Q6.5(D) Q6.6(D) Q6.7(D) Q6.8(D) ; port BCO Ctrl
UC Regen Ctrl: R39.2 R59.2 ; port UC Regen Ctrl
NetQ6_4: Q6.4(G) R39.1

### Notes on the sheet
- (in symbol CMP-2000-06466-1) 5, 6, 7, 8; 1, 2, 3

### Library data of the parts
Q6 = CMP-2000-06466-1: HEXFET (R) Power MOSFET, 30 V, -55 to 150 degC, 8-Pin SO, RoHS, Tube; Manufacturer: International Rectifier; Rated Power Dissipation: 2.5W; Qg Gate Charge: 52nC; Channel Type: N-Channel; Drain-to-Source Voltage [Vdss]: 30V; Drain-Source On Resistance-Max: 0.011O; Mounting Technology: SurfaceMount; Datasheet URL: http://www.infineon.com/dgdl/irf7413pbf.pdf?fileId=5546d462533600a4015355fa8e901bb8; Package Description: 8-Pin Small Outline Integrated Circuit, Body 4.9 x 3.9 mm, Pitch 1.27 mm; Package Reference: SO-8; Datasheet Version: 02/2008; Manufacturer URL: http://internationalrectifier.com/; Supplier 1: Digi-Key
R39 = CMP-1012-00397-1: 100R 0.1W 1% 0603 (1608 Metric)  SMD; Value: 100.00 Ohm; Case-EIA: 0603; Case-Metric: 1608; Technology: SMT; Tolerance: 1 %; Power: 0.1 W
R59 = CMP-1012-00623-1: 10K 0.1W 1% 0603 (1608 Metric)  SMD; Value: 10000.00 Ohm; Case-EIA: 0603; Case-Metric: 1608; Power: 0.1 W; Tolerance: 1 %; Technology: SMT

## Nets that join several sheets
3v3: 1-Controller (15 pins), 2-Power (C18.2 R7.1 R8.2 REG2.3), 3-CAN (C19.2 C24.2 U2.3 U3.3), 4-PPS (D5.2 D6.2), 5-Connector (D9.2 D10.2 D11.2 D23.2), 8-Bluetooth (BT1.2 BT1.16 C28.2 C29.2), 9-Other_Inputs (D18.2)
3v3Ref: 1-Controller (C3.2 U1.21), 2-Power (C11.2 Ref1.6)
5v: 2-Power (C14.2 R6.1 REG1.3), 5-Connector (F1.1 F2.1), 9-Other_Inputs (R20.2), 10-DashLEDs (16 pins)
GND: 1-Controller (23 pins), 2-Power (16 pins), 3-CAN (6 pins), 4-PPS (8 pins), 5-Connector (11 pins), 8-Bluetooth (8 pins), 9-Other_Inputs (11 pins), 10-DashLEDs (8 pins), 12-Dash_Inputs (12 pins), 14-RegenSolenoid (Q6.1 Q6.2 Q6.3 R59.1)
Vbatt: 2-Power (10 pins), 9-Other_Inputs (R43.1 R46.2), 12-Dash_Inputs (R22.2 R25.2 R31.2 R36.2)
~{Brake Pres}s: 5-Connector (CN1.10), 9-Other_Inputs (R20.1 R21.1)
APPS 1 5V: 4-PPS (R16.1 R18.2), 5-Connector (CN1.1)
APPS 2 5V: 4-PPS (R12.1 R14.2), 5-Connector (CN1.4)
BCO Ctrl: 5-Connector (CN1.32), 14-RegenSolenoid (Q6.5 Q6.6 Q6.7 Q6.8)
BT NCTS: 1-Controller (U1.58), 8-Bluetooth (BT1.10)
BT NRTS: 1-Controller (U1.59), 8-Bluetooth (BT1.5)
BT Reset: 1-Controller (U1.57), 8-Bluetooth (BT1.17)
CAN Rx: 1-Controller (U1.95), 3-CAN (R9.2)
CAN Tx: 1-Controller (U1.96), 3-CAN (R10.2)
CAN_N: 3-CAN (D4.2 R11.1 U2.6), 5-Connector (CN1.35)
CAN_P: 3-CAN (D4.1 R11.2 U2.7), 5-Connector (CN1.34)
Dash Power: 5-Connector (CN1.27), 13-Fusing (F11.2)
Dash Toggle: 5-Connector (CN1.9), 12-Dash_Inputs (R31.1 R34.1)
GLV Power In: 5-Connector (CN1.22), 13-Fusing (F8.1 F9.1 F10.1 F11.1)
NRST: 1-Controller (C1.2 U1.14), 5-Connector (D9.3 F5.1)
Regen Btn: 5-Connector (CN1.11), 12-Dash_Inputs (R36.1 R37.1)
RTD BTN: 5-Connector (CN1.8), 12-Dash_Inputs (R22.1 R23.1)
RTD LED 1: 1-Controller (U1.3), 10-DashLEDs (R52.2)
RTD LED 1 Output: 5-Connector (CN1.14), 10-DashLEDs (IReg2.5 IReg2.6 IReg2.7 IReg2.8)
RTD LED 2: 1-Controller (U1.1), 10-DashLEDs (R58.2)
RTD LED 2 Output: 5-Connector (CN1.17), 10-DashLEDs (IReg4.5 IReg4.6 IReg4.7 IReg4.8)
Sensor CAN Rx: 1-Controller (U1.91), 3-CAN (R28.2)
Sensor CAN Tx: 1-Controller (U1.92), 3-CAN (R29.2)
Sensor_CAN_N: 3-CAN (D21.2 R30.1 U3.6), 5-Connector (CN1.38)
Sensor_CAN_P: 3-CAN (D21.1 R30.2 U3.7), 5-Connector (CN1.37)
Shutdown Tap: 5-Connector (CN1.31), 9-Other_Inputs (R40.2 R42.2)
SWDIO: 1-Controller (U1.72), 5-Connector (D23.3 F3.1)
TSA BTN: 5-Connector (CN1.7), 12-Dash_Inputs (R25.1 R26.1)
TSA LED 1: 1-Controller (U1.4), 10-DashLEDs (R49.2)
TSA LED 1 Output: 5-Connector (CN1.13), 10-DashLEDs (IReg1.5 IReg1.6 IReg1.7 IReg1.8)
TSA LED 2: 1-Controller (U1.2), 10-DashLEDs (R55.2)
TSA LED 2 Output: 5-Connector (CN1.16), 10-DashLEDs (IReg3.5 IReg3.6 IReg3.7 IReg3.8)
UC APPS 1: 1-Controller (U1.15), 4-PPS (C21.2 D6.3 R17.2 R19.2)
UC APPS 2: 1-Controller (U1.30), 4-PPS (C20.2 D5.3 R13.2 R15.2)
UC BPS: 1-Controller (U1.17), 9-Other_Inputs (C26.2 D3.2 R60.2)
UC BT Rx: 1-Controller (U1.56), 8-Bluetooth (R32.2)
UC BT Tx: 1-Controller (U1.55), 8-Bluetooth (R33.1)
UC Dash Toggle: 1-Controller (U1.37), 12-Dash_Inputs (C31.2 D15.2 R35.2)
UC Regen Btn: 1-Controller (U1.34), 12-Dash_Inputs (C38.2 D20.2 R38.2)
UC Regen Ctrl: 1-Controller (U1.84), 14-RegenSolenoid (R39.2 R59.2)
UC RTD BTN: 1-Controller (U1.36), 12-Dash_Inputs (C27.2 D8.2 R24.2)
UC Shutdown Tap: 1-Controller (U1.87), 9-Other_Inputs (C32.2 D16.2 R41.1)
UC SWCLK: 1-Controller (U1.76), 5-Connector (D11.3 F7.1)
UC SWO: 1-Controller (U1.89), 5-Connector (D10.3 F6.1)
UC TSA BTN: 1-Controller (U1.35), 12-Dash_Inputs (C30.2 D13.2 R27.2)
UC Vbatt: 1-Controller (U1.32), 9-Other_Inputs (C33.2 D18.3 R44.2 R45.2)
VCU Power: 2-Power (Q1.3), 13-Fusing (F8.2)
WB Power 1: 5-Connector (CN1.25), 13-Fusing (F9.2)
WB Power 2: 5-Connector (CN1.26), 13-Fusing (F10.2)